# Altium project Altium.PrjPcb
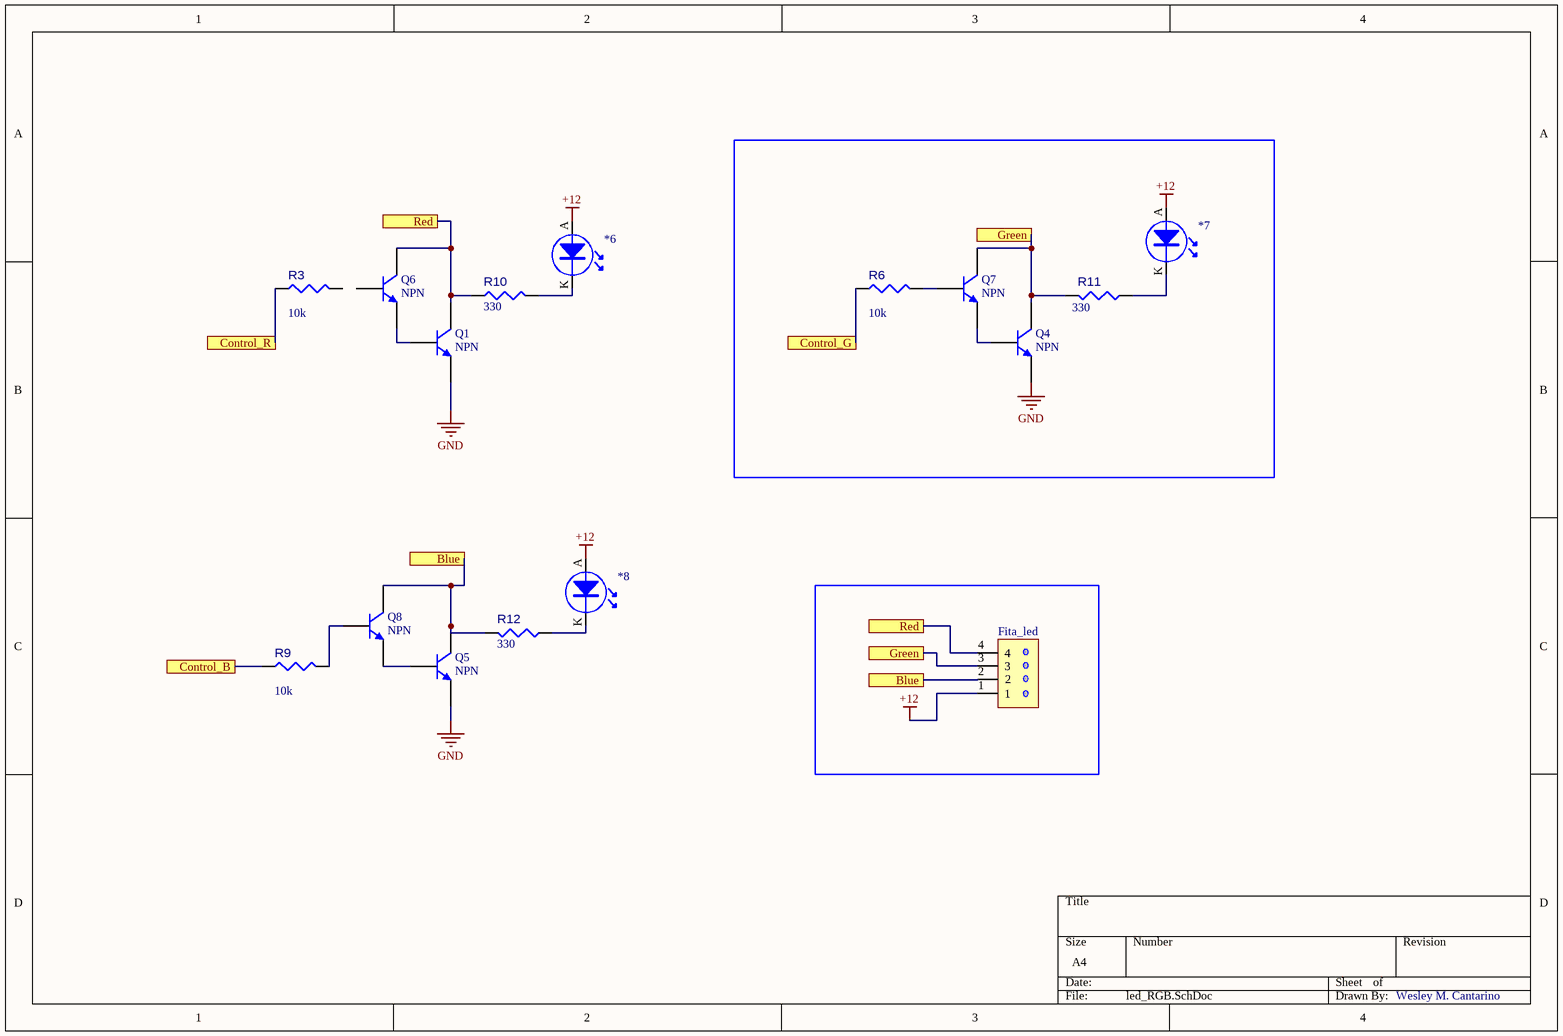
[diagram p0: led_RGB.SchDoc]
3 sheets, 40 parts. Net scope: flat (ports and power ports of the same name join across sheets).
Board files: PCB1.PcbDoc, PCB2.PcbDoc
Sheets:
  led_RGB.SchDoc
  relay.SchDoc
  main.SchDoc

## Sheet led_RGB.SchDoc
size A4

### Parts
*6  LED_AXIAL_5MM  [HEADER_1X2]  (value not drawn)
*7  LED_AXIAL_5MM  [HEADER_1X2]  (value not drawn)
*8  LED_AXIAL_5MM  [HEADER_1X2]  (value not drawn)
Fita_led  CN_KK_4  [CN_KK_4_5045-4]  (value not drawn)
Q1  NPN  [HEADER_1X3]
Q4  NPN  [HEADER_1X3]
Q5  NPN  [HEADER_1X3]
Q6  NPN  [HEADER_1X3]
Q7  NPN  [HEADER_1X3]
Q8  NPN  [HEADER_1X3]
R3  10k  [RES_PTH_7.62MM]
R6  10k  [RES_PTH_7.62MM]
R9  10k  [RES_PTH_7.62MM]
R10  330  [RES_PTH_7.62MM]
R11  330  [RES_PTH_7.62MM]
R12  330  [RES_PTH_7.62MM]

### Ports
Blue, Control_B, Control_G, Control_R, Green, Red

### Nets
+12: *6.A *7.A *8.A Fita_led.1
GND: Q1.3(E) Q4.3(E) Q5.3(E)
Net*6_K: *6.K R10.2
Net*7_K: *7.K R11.1
Net*8_K: *8.K R12.1
NetFita_led_2: Fita_led.2 Q5.1(C) Q8.1(C) R12.2 ; port Blue
NetFita_led_3: Fita_led.3 Q4.1(C) Q7.1(C) R11.2 ; port Green
NetFita_led_4: Fita_led.4 Q1.1(C) Q6.1(C) R10.1 ; port Red
NetNodeMCU_21: R9.1 ; port Control_B
NetNodeMCU_22: R6.1 ; port Control_G
NetNodeMCU_23: R3.1 ; port Control_R
NetQ1_2: Q1.2(B) Q6.3(E)
NetQ4_2: Q4.2(B) Q7.3(E)
NetQ5_2: Q5.2(B) Q8.3(E)
NetQ7_2: Q7.2(B) R6.2
NetQ8_2: Q8.2(B) R9.2

Not connected (* = marked no-connect by the designer): Q6 2(B); R3 2

### Notes on the sheet
- Wesley M. Cantarino

### Library data of the parts
*6-*8 = LED_AXIAL_5MM: pin to pad: A>1 K>2; Value: ?
Fita_led = CN_KK_4: KK_4; Value: ?
Q1 Q4-Q8 = NPN: NPN Bipolar Transistor; pin to pad: 1>2 2>1; Published: 8-Jun-2000; LatestRevisionDate: 17-Jul-2002; LatestRevisionNote: Re-released for DXP Platform.; PackageReference: TO-226-AA; Publisher: Altium Limited; PackageDescription: TO, Flat Index; 3 In-Line, Axial Leads; Body Dia. 4.8mm; Leads 0.55 x 0.51 mm (max); Code_JEDEC: TO-226-AA
R3 R6 R9-R12 = RES_PTH_7.62MM: Pin Through Hole Resistor 7.62mm
  R3 R6 R9: Value: 10k
  R10-R12: Value: 330

## Sheet relay.SchDoc
size A4
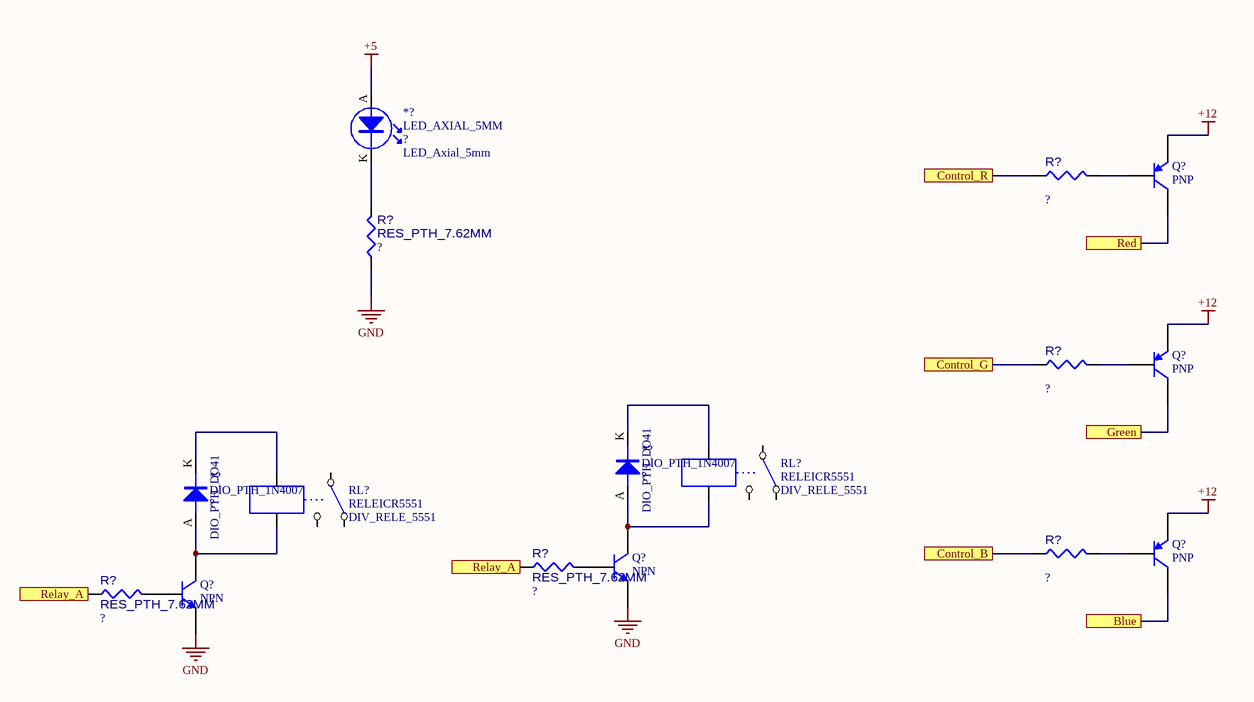
[diagram p1: relay.SchDoc]

### Parts
(Parts that share a designator on the sheet are numbered #1, #2 ... from top to bottom, then left to right.)
*?#1  LED_AXIAL_5MM  [LED_Axial_5mm]
*?#2  DIO_PTH_1N4007  [DIO_PTH_DO41]
*?#3  DIO_PTH_1N4007  [DIO_PTH_DO41]
Q?#1  PNP  [SOT-23B_L]
Q?#2  PNP  [SOT-23B_L]
Q?#3  PNP  [SOT-23B_L]
Q?#4  NPN  [TO-226-AA]
Q?#5  NPN  [TO-226-AA]
R?#1  ?  [RES_PTH_7.62MM]
R?#2  ?  [RES_PTH_7.62MM]
R?#3  ?  [RES_PTH_7.62MM]
R?#4  ?  [RES_PTH_7.62MM]
R?#5  ?  [RES_PTH_7.62MM]
R?#6  ?  [RES_PTH_7.62MM]
RL?#1  RELEICR5551  [DIV_RELE_5551]
RL?#2  RELEICR5551  [DIV_RELE_5551]

### Ports
Blue, Control_B, Control_G, Control_R, Green, Red, Relay_A

### Nets
+5: *?#1.A
+12: Q?#1.3(E) Q?#2.3(E) Q?#3.3(E)
GND: Q?#4.3(E) Q?#5.3(E) R?#2.1
Net*?#1_K: *?#1.K R?#2.2
Net*?#2_A: *?#2.A Q?#4.1(C) RL?#1.5
Net*?#2_K: *?#2.K RL?#1.4
Net*?#3_A: *?#3.A Q?#5.1(C) RL?#2.5
Net*?#3_K: *?#3.K RL?#2.4
NetFita_led_2: Q?#3.1(C) ; port Blue
NetFita_led_3: Q?#2.1(C) ; port Green
NetFita_led_4: Q?#1.1(C) ; port Red
NetNodeMCU_21: R?#4.1 ; port Control_B
NetNodeMCU_22: R?#3.1 ; port Control_G
NetNodeMCU_23: R?#1.1 ; port Control_R
NetNodeMCU_27: R?#5.1 R?#6.1 ; port Relay_A
NetQ?#1_2: Q?#1.2(B) R?#1.2
NetQ?#2_2: Q?#2.2(B) R?#3.2
NetQ?#3_2: Q?#3.2(B) R?#4.2
NetQ?#4_2: Q?#4.2(B) R?#5.2
NetQ?#5_2: Q?#5.2(B) R?#6.2

Not connected (* = marked no-connect by the designer): RL?#1 1 2 3; RL?#2 1 2 3

### Library data of the parts
Q?#1-Q?#3 = PNP: PNP Bipolar Transistor; Published: 8-Jun-2000; LatestRevisionDate: 29-May-2009; LatestRevisionNote: IPC-7351 Footprint Added.; PackageVersion: Aug-1999; PackageReference: SOT-23B; Publisher: Altium Limited; PackageDescription: 3-Pin SOT-23 Package 0.95 mm Pitch, 2.4 mm Lead Span
Q?#4 Q?#5 = NPN: NPN Bipolar Transistor; Published: 8-Jun-2000; LatestRevisionDate: 17-Jul-2002; LatestRevisionNote: Re-released for DXP Platform.; PackageReference: TO-226-AA; Publisher: Altium Limited; PackageDescription: TO, Flat Index; 3 In-Line, Axial Leads; Body Dia. 4.8mm; Leads 0.55 x 0.51 mm (max); Code_JEDEC: TO-226-AA
R?#1-R?#6 = RES_PTH_7.62MM: Pin Through Hole Resistor 7.62mm; Value: ?
*?#1 = LED_AXIAL_5MM: Value: ?
*?#2 *?#3 = DIO_PTH_1N4007: Value: ?
RL?#1 RL?#2 = RELEICR5551: Value: RELEICR5551

## Sheet main.SchDoc
size A4
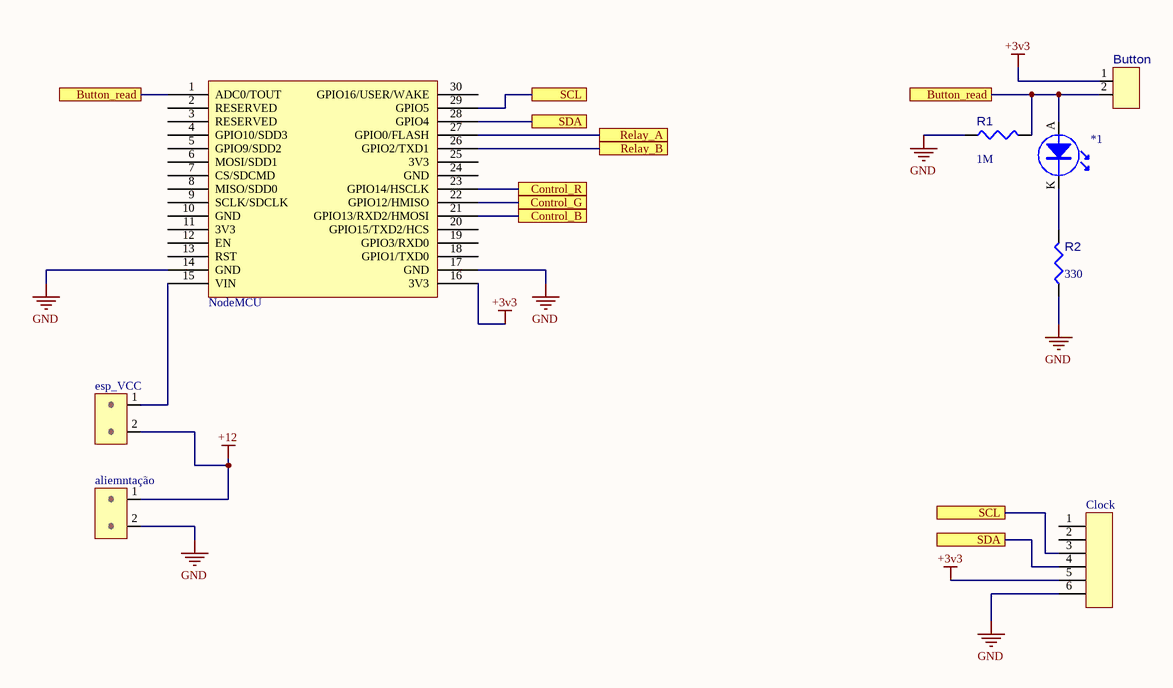
[diagram p2: main.SchDoc]

### Parts
*1  LED_AXIAL_5MM  [HEADER_1X2]  (value not drawn)
aliemntação  ?  [CN_KRE_2]  (value not drawn)
Button  ?  [HEADER_1X2]  (value not drawn)
Clock  HEADER_1X6  [HEADER_1X6]  (value not drawn)
esp_VCC  ?  [HEADER_1X2]  (value not drawn)
NodeMCU  ESP8266 Development kit  [DIV_NodeMCU_Socket]  (value not drawn)
R1  1M  [RES_PTH_7.62MM]
R2  value 330  [RES_PTH_7.62MM]

### Ports
Button_read, Control_B, Control_G, Control_R, Relay_A, Relay_B, SCL, SDA

### Nets
+3v3: Button.1 Clock.5 NodeMCU.16(3V3)
+12: aliemntação.1 esp_VCC.2
GND: aliemntação.2 Clock.6 NodeMCU.14(GND) NodeMCU.17(GND) R1.1 R2.1
Net*1_A: *1.A Button.2 NodeMCU.1(ADC0/TOUT) R1.2 ; port Button_read
Net*1_K: *1.K R2.2
NetClock_3: Clock.3 NodeMCU.29(GPIO5) ; port SCL
NetClock_4: Clock.4 NodeMCU.28(GPIO4) ; port SDA
Netesp_VCC_1: esp_VCC.1 NodeMCU.15(VIN)
NetNodeMCU_21: NodeMCU.21(GPIO13/RXD2/HMOSI) ; port Control_B
NetNodeMCU_22: NodeMCU.22(GPIO12/HMISO) ; port Control_G
NetNodeMCU_23: NodeMCU.23(GPIO14/HSCLK) ; port Control_R
NetNodeMCU_26: NodeMCU.26(GPIO2/TXD1) ; port Relay_B
NetNodeMCU_27: NodeMCU.27(GPIO0/FLASH) ; port Relay_A

Not connected (* = marked no-connect by the designer): Clock 1 2; NodeMCU 2(RESERVED) 3(RESERVED) 4(GPIO10/SDD3) 5(GPIO9/SDD2) 6(MOSI/SDD1) 7(CS/SDCMD) 8(MISO/SDD0) 9(SCLK/SDCLK) 10(GND) 11(3V3) 12(EN) 13(RST) 18(GPIO1/TXD0) 19(GPIO3/RXD0) 20(GPIO15/TXD2/HCS) 24(GND) 25(3V3) 30(GPIO16/USER/WAKE)

### Library data of the parts
*1 = LED_AXIAL_5MM: pin to pad: A>1 K>2; Value: ?
aliemntação esp_VCC = CN_MKDS_2: MKDS_2; Value: ?
Button = HEADER_1X2: 1X2; Value: ?
Clock = HEADER_1X6: 1X6; Value: ?
NodeMCU = NodeMCU: Reference: https://bennthomsen.files.wordpress.com/2015/12/nodemcu_pinout_700-2.png; Schematic: https://raw.githubusercontent.com/nodemcu/nodemcu-devkit/master/Documents/NODEMCU_DEVKIT_SCH.png
R1 R2 = RES_PTH_7.62MM: Pin Through Hole Resistor 7.62mm
  R1: Value: 1M

## Nets that join several sheets
+12: led_RGB (*6.A *7.A *8.A Fita_led.1), relay (Q?#1.3 Q?#2.3 Q?#3.3), main (aliemntação.1 esp_VCC.2)
GND: led_RGB (Q1.3 Q4.3 Q5.3), relay (Q?#4.3 Q?#5.3 R?#2.1), main (6 pins)
NetFita_led_2: led_RGB (Fita_led.2 Q5.1 Q8.1 R12.2), relay (Q?#3.1)
NetFita_led_3: led_RGB (Fita_led.3 Q4.1 Q7.1 R11.2), relay (Q?#2.1)
NetFita_led_4: led_RGB (Fita_led.4 Q1.1 Q6.1 R10.1), relay (Q?#1.1)
NetNodeMCU_21: led_RGB (R9.1), relay (R?#4.1), main (NodeMCU.21)
NetNodeMCU_22: led_RGB (R6.1), relay (R?#3.1), main (NodeMCU.22)
NetNodeMCU_23: led_RGB (R3.1), relay (R?#1.1), main (NodeMCU.23)
NetNodeMCU_27: relay (R?#5.1 R?#6.1), main (NodeMCU.27)